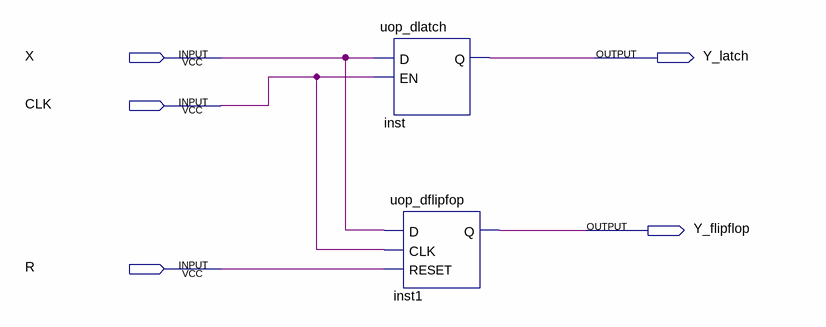
[diagram p0: schematic sheet]
// Quartus schematic behavioural.bdf as structural Verilog: 2 symbols, 5 pins
module behavioural (
  input  X,
  input  CLK,
  input  R,
  output Y_latch,
  output Y_flipflop
);

  uop_dlatch inst (.D(X), .EN(CLK), .Q(Y_latch));
  uop_dflipfop inst1 (.D(X), .CLK(CLK), .RESET(R), .Q(Y_flipflop));
endmodule
